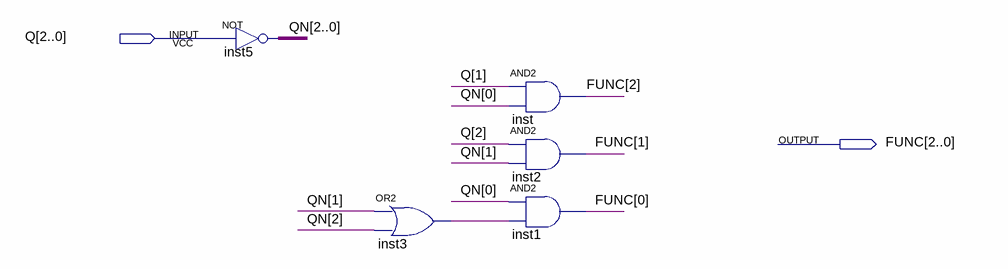
[diagram p0: schematic sheet]
// Quartus schematic EN.bdf as structural Verilog: 5 symbols, 2 pins
module EN (
  input  [2:0] Q,
  output [2:0] FUNC
);

  wire inst3_out;
  wire [2:0] QN;

  assign QN = ~Q;  // NOT inst5, 3 bits wide
  or inst3 (inst3_out, QN[1], QN[2]);
  and inst (FUNC[2], Q[1], QN[0]);
  and inst2 (FUNC[1], Q[2], QN[1]);
  and inst1 (FUNC[0], QN[0], inst3_out);
endmodule
